# EasyEDA schematic SCH_YY.json
TITLE: Sheet_1; REV: 1.0; Date: 2026-08-25; Sheet: 1/1; Drawn By: minionmark; Company: Your Company
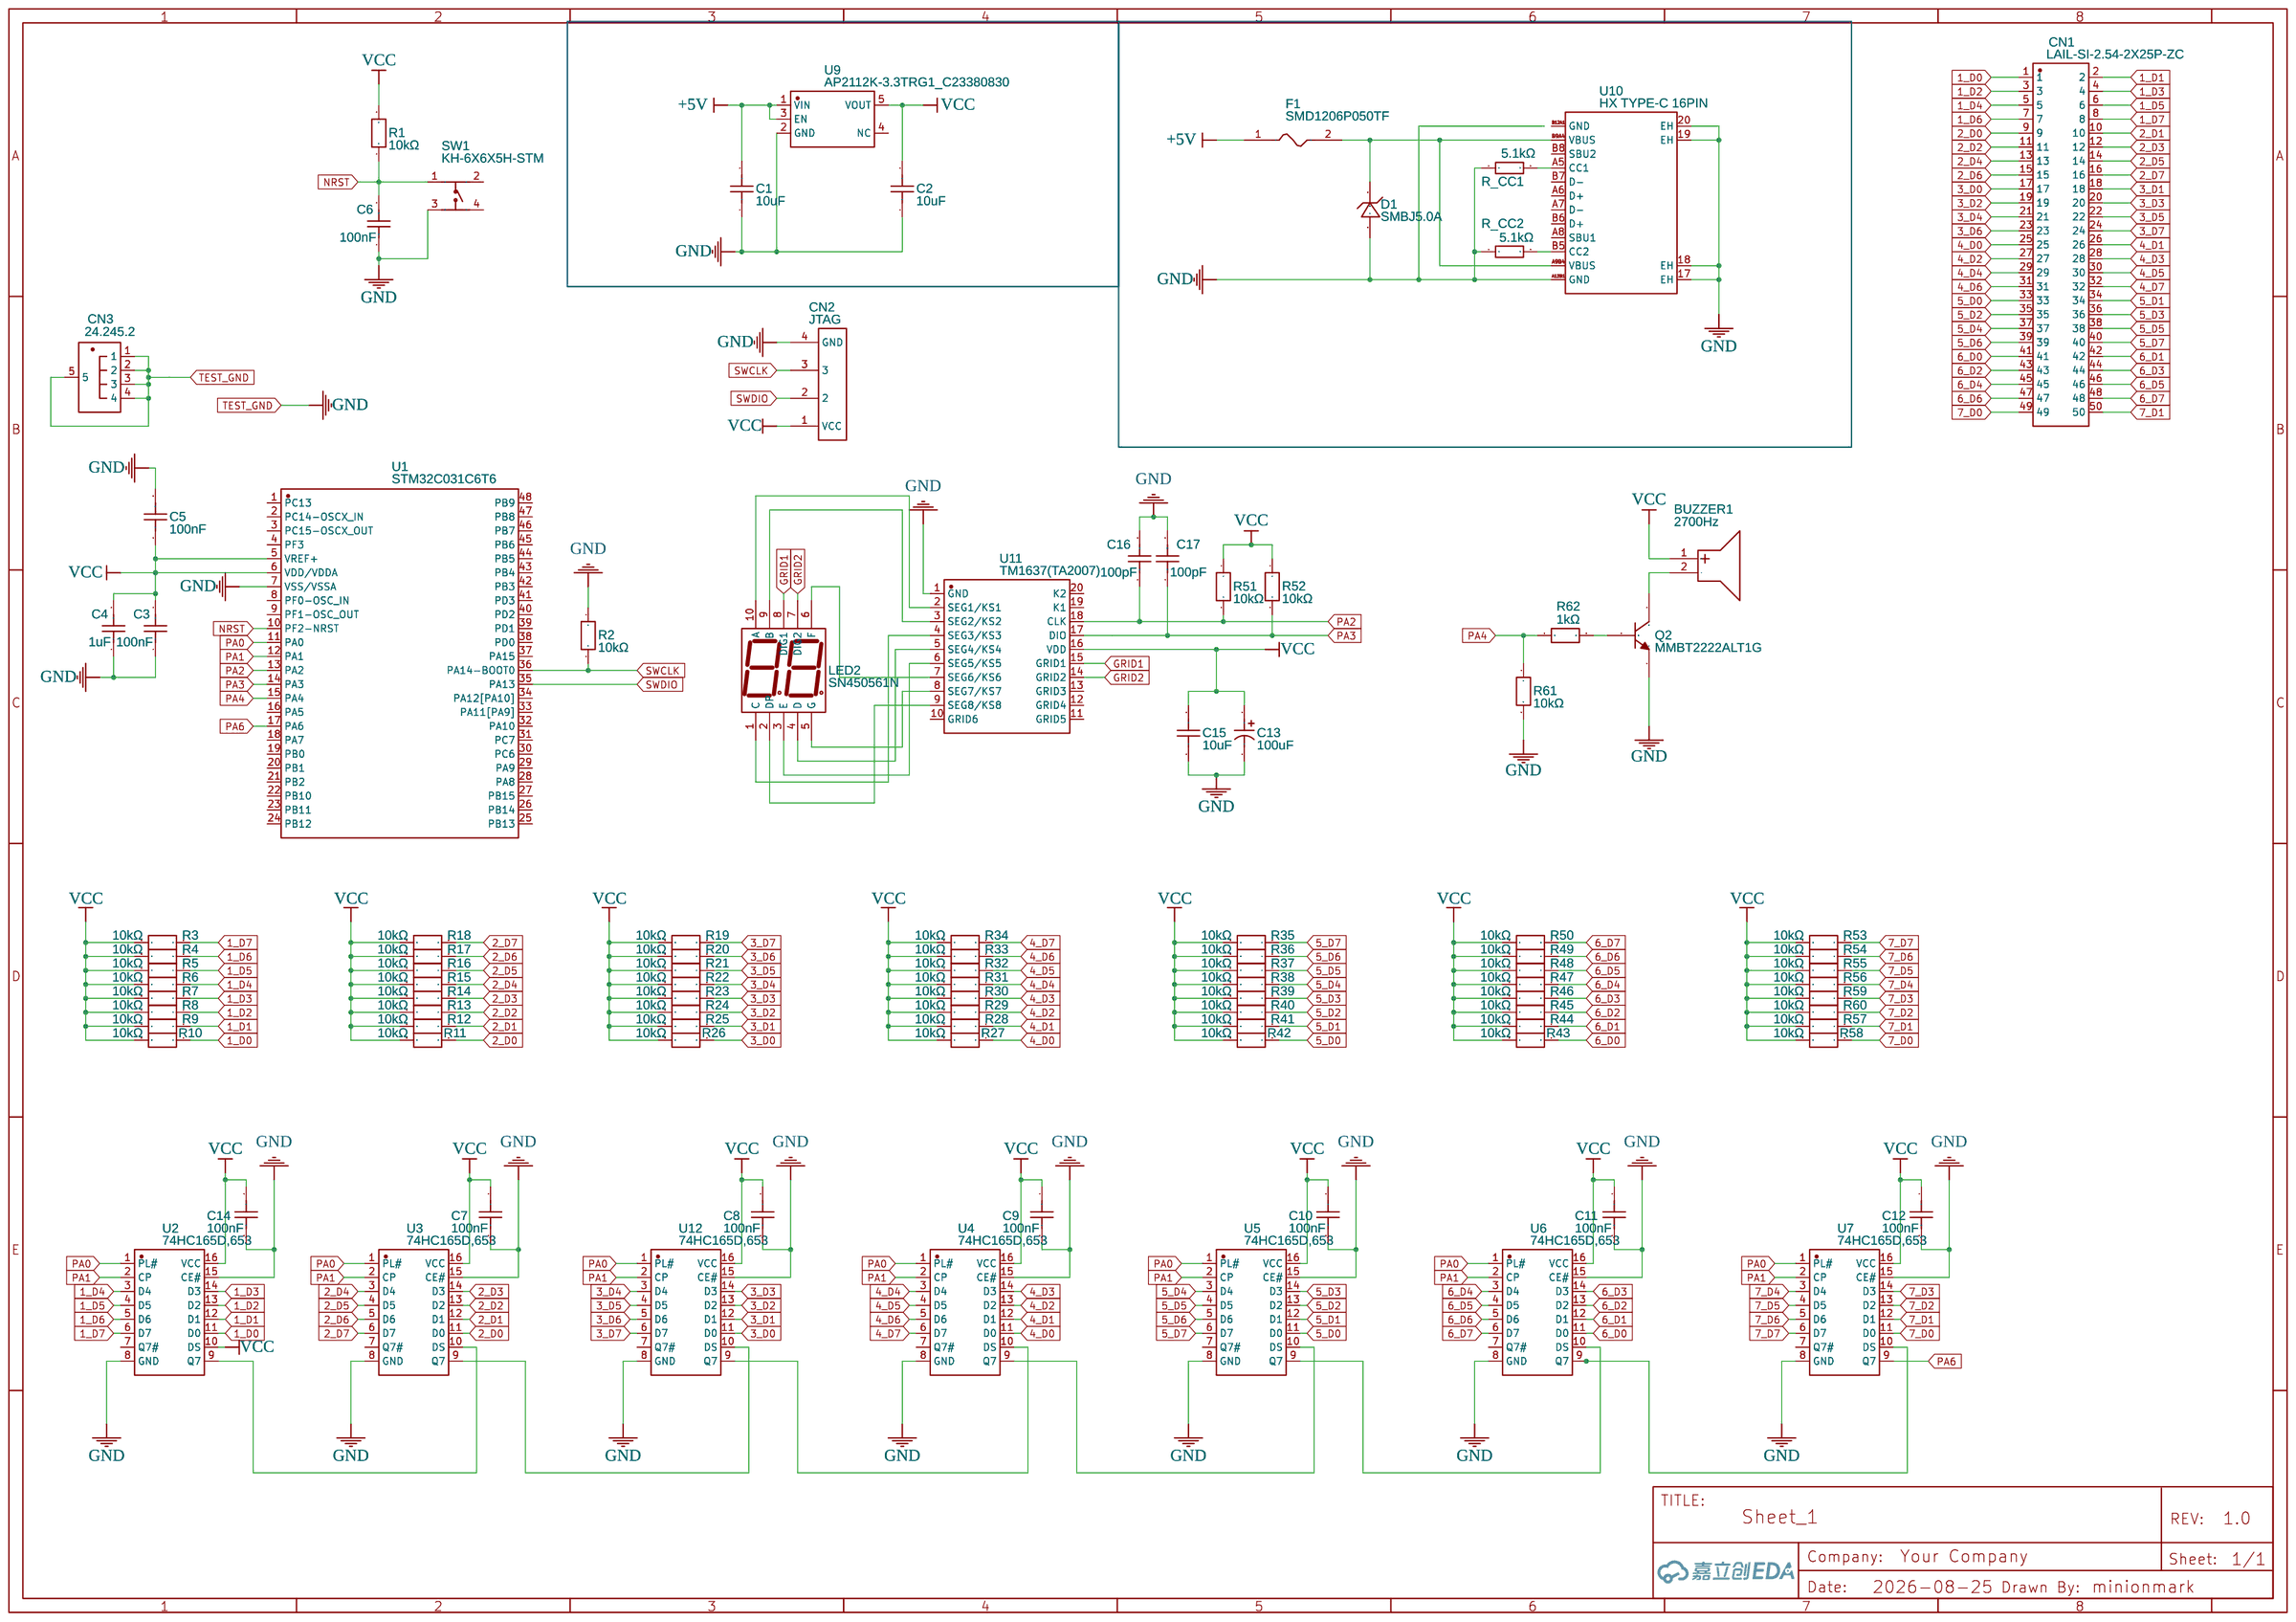
[diagram p0: schematic sheet]

## Parts
BUZZER1  2700Hz  [BUZ-SMD_GSD9605YB-3V2800]
C1  10uF  [C0603]
C2  10uF  [C0603]
C3  100nF  [C0603]
C4  1uF  [C0603]
C5  100nF  [C0603]
C6  100nF  [C0603]
C7  100nF  [C0603]
C8  100nF  [C0603]
C9  100nF  [C0603]
C10  100nF  [C0603]
C11  100nF  [C0603]
C12  100nF  [C0603]
C13  100uF  [CAP-SMD_BD6.3-L6.6-W6.6-FD-1]
C14  100nF  [C0603]
C15  10uF  [C0603]
C16  100pF  [C0603]
C17  100pF  [C0603]
CN1  LAIL-SI-2.54-2X25P-ZC  [IDC-TH_50P-P2.54-V-M-R2-C25-S2.54]
CN2  JTAG  [JTAG]
CN3  24.245.2  [ANT-TH_L33.0-W12.0_BLACK]
D1  SMBJ5.0A  [SMB_L4.6-W3.6-LS5.3-RD]
F1  SMD1206P050TF  [F1206]
LED2  SN450561N  [LED-SEG-TH_10P-L25.0-W19.0-P2.54-S15.24-BL]
Q2  MMBT2222ALT1G  [SOT-23-3_L2.9-W1.3-P1.90-LS2.4-BR]
R1  10kΩ  [R0603]
R2  10kΩ  [R0603]
R3  10kΩ  [R0603]
R4  10kΩ  [R0603]
R5  10kΩ  [R0603]
R6  10kΩ  [R0603]
R7  10kΩ  [R0603]
R8  10kΩ  [R0603]
R9  10kΩ  [R0603]
R10  10kΩ  [R0603]
R11  10kΩ  [R0603]
R12  10kΩ  [R0603]
R13  10kΩ  [R0603]
R14  10kΩ  [R0603]
R15  10kΩ  [R0603]
R16  10kΩ  [R0603]
R17  10kΩ  [R0603]
R18  10kΩ  [R0603]
R19  10kΩ  [R0603]
R20  10kΩ  [R0603]
R21  10kΩ  [R0603]
R22  10kΩ  [R0603]
R23  10kΩ  [R0603]
R24  10kΩ  [R0603]
R25  10kΩ  [R0603]
R26  10kΩ  [R0603]
R27  10kΩ  [R0603]
R28  10kΩ  [R0603]
R29  10kΩ  [R0603]
R30  10kΩ  [R0603]
R31  10kΩ  [R0603]
R32  10kΩ  [R0603]
R33  10kΩ  [R0603]
R34  10kΩ  [R0603]
R35  10kΩ  [R0603]
R36  10kΩ  [R0603]
R37  10kΩ  [R0603]
R38  10kΩ  [R0603]
R39  10kΩ  [R0603]
R40  10kΩ  [R0603]
R41  10kΩ  [R0603]
R42  10kΩ  [R0603]
R43  10kΩ  [R0603]
R44  10kΩ  [R0603]
R45  10kΩ  [R0603]
R46  10kΩ  [R0603]
R47  10kΩ  [R0603]
R48  10kΩ  [R0603]
R49  10kΩ  [R0603]
R50  10kΩ  [R0603]
R51  10kΩ  [R0603]
R52  10kΩ  [R0603]
R53  10kΩ  [R0603]
R54  10kΩ  [R0603]
R55  10kΩ  [R0603]
R56  10kΩ  [R0603]
R57  10kΩ  [R0603]
R58  10kΩ  [R0603]
R59  10kΩ  [R0603]
R60  10kΩ  [R0603]
R61  10kΩ  [R0603]
R62  1kΩ  [R0603]
R_CC1  5.1kΩ  [R0603]
R_CC2  5.1kΩ  [R0603]
SW1  KH-6X6X5H-STM  [SW-SMD_4P-L6.0-W6.0-P4.50-LS9.0_H5.0]
U1  STM32C031C6T6  [LQFP-48_L7.0-W7.0-P0.50-LS9.0-BL]
U2  74HC165D,653  [SOIC-16_L9.9-W3.9-P1.27-LS6.0-BL]
U3  74HC165D,653  [SOIC-16_L9.9-W3.9-P1.27-LS6.0-BL]
U4  74HC165D,653  [SOIC-16_L9.9-W3.9-P1.27-LS6.0-BL]
U5  74HC165D,653  [SOIC-16_L9.9-W3.9-P1.27-LS6.0-BL]
U6  74HC165D,653  [SOIC-16_L9.9-W3.9-P1.27-LS6.0-BL]
U7  74HC165D,653  [SOIC-16_L9.9-W3.9-P1.27-LS6.0-BL]
U9  AP2112K-3.3TRG1_C23380830  [SOT-23-5_L2.9-W1.6-P0.95-LS2.8-BR]
U10  HX TYPE-C 16PIN  [TYPE-C-SMD_HX-TYPE-C-16PIN]
U11  TM1637(TA2007)  [SOP-20_L12.8-W7.5-P1.27-LS10.4-BL]
U12  74HC165D,653  [SOIC-16_L9.9-W3.9-P1.27-LS6.0-BL]

## Library data of the parts
BUZZER1 = GSD9605YB-3V2800: Contributor: LCSC; Supplier: LCSC; Supplier Part: C255327; Manufacturer: INGHAi(赢海); JLCPCB Part Class: Extended Part
C1 C2 C15 = FCC0603X106K100CT: Contributor: lcsc; Supplier: LCSC; Supplier Part: C5137565; Manufacturer: FOJAN(富捷); JLCPCB Part Class: Extended Part
C3 C5-C12 C14 = 0603ZD104KAT2A: Supplier: LCSC; Supplier Part: C1856507; Manufacturer: Kyocera AVX; JLCPCB Part Class: Extended Part; Contributor: lcsc
C4 = 0603X105K100NT: Contributor: LCSC; Supplier: LCSC; Supplier Part: C111590; Manufacturer: FH(风华); JLCPCB Part Class: Extended Part; link: https://so.szlcsc.com/global.html?k=C111590&ref=editor
C13 = JVJ25V100M6X5: Supplier: LCSC; Supplier Part: C46550402; Manufacturer: JIERR(捷而瑞); Manufacturer Part: JVJ25V100M6x5; JLCPCB Part Class: Extended Part; Contributor: lcsc
C16 C17 = CC0603JRNPO9BN101: Supplier: LCSC; Manufacturer: YAGEO(国巨); Supplier Part: C14665; JLCPCB Part Class: Extended Part
CN1 = LAIL-SI-2.54-2X25P-ZC: Supplier: LCSC; Supplier Part: C55118377; Manufacturer: 莱联; Contributor: lcsc; JLCPCB Part Class: Extended Part
CN2 = JTAG: Contributor: minionmark; Package Display: No
CN3 = 24.245.2: Supplier: LCSC; Supplier Part: C7437327; Manufacturer: AMASS(艾迈斯); Contributor: lcsc; JLCPCB Part Class: Extended Part
D1 = SMBJ5.0A-C113974: Supplier: LCSC; Manufacturer: MDD(辰达半导体); Supplier Part: C113974; JLCPCB Part Class: Extended Part
F1 = SMD1206P050TF: Supplier: LCSC; Manufacturer: RUILON(瑞隆源); Supplier Part: C20799; JLCPCB Part Class: Extended Part
LED2 = SN450561N: Contributor: LCSC; Supplier: LCSC; Supplier Part: C193143; Manufacturer: ARKLED(方舟); JLCPCB Part Class: Extended Part
Q2 = MMBT2222ALT1G: Supplier: LCSC; Manufacturer: onsemi(安森美); Supplier Part: C82460; JLCPCB Part Class: Extended Part
R1-R61 = FRC0603J103TS: Contributor: LCSC; Supplier: LCSC; Supplier Part: C2930027; Manufacturer: FOJAN(富捷); Manufacturer Part: FRC0603J103 TS; JLCPCB Part Class: Extended Part
R62 = FRC0603F1001TS: Contributor: lcsc; Supplier: LCSC; Supplier Part: C2907002; Manufacturer: FOJAN(富捷); JLCPCB Part Class: Extended Part
R_CC1 R_CC2 = RT0603BRD075K1L: Supplier: LCSC; Manufacturer: YAGEO(国巨); Supplier Part: C122969; JLCPCB Part Class: Extended Part
SW1 = KH-6X6X5H-STM: Contributor: LCSC; Supplier: LCSC; Supplier Part: C2837531; Manufacturer: kinghelm(金航标); JLCPCB Part Class: Extended Part
U1 = STM32C031C6T6: Contributor: lcsc; Supplier: LCSC; Supplier Part: C5456218; Manufacturer: ST(意法半导体); JLCPCB Part Class: Extended Part
U2-U7 U12 = 74HC165D,653: Supplier: LCSC; Manufacturer: Nexperia(安世); Supplier Part: C5613; JLCPCB Part Class: Extended Part
U9 = AP2112K-3.3TRG1_C23380830: Supplier: LCSC; Supplier Part: C23380830; Manufacturer: TECH PUBLIC(台舟); Manufacturer Part: AP2112K-3.3TRG1; Contributor: lcsc; JLCPCB Part Class: Extended Part
U10 = HX TYPE-C 16PIN: Supplier: LCSC; Supplier Part: C5178539; Manufacturer: hanxia(韩下); JLCPCB Part Class: Extended Part; Contributor: lcsc
U11 = TM1637(TA2007): Contributor: lcsc; Supplier: LCSC; Supplier Part: C5337160; Manufacturer: TM(天微); JLCPCB Part Class: Extended Part

## Nets
+5V: C1.2 F1.1 U9.1(VIN) U9.3(EN)
GND: C1.1 C2.1 C3.1 C4.1 C5.2 C6.1 C7.2 C8.2 C9.2 C10.2 C11.2 C12.2 C13.2 C14.2 C15.1 C16.2 C17.2 CN2.4(GND) CN3.1 CN3.2 CN3.3 CN3.4 CN3.5 D1.2(A) Q2.2(E) R2.1 R61.2 R_CC1.1 R_CC2.1 SW1.3 U1.7(VSS/VSSA) U2.8(GND) U2.15(CE#) U3.8(GND) U3.15(CE#) U4.8(GND) U4.15(CE#) U5.8(GND) U5.15(CE#) U6.8(GND) U6.15(CE#) U7.8(GND) U7.15(CE#) U9.2(GND) U10.17(EH) U10.18(EH) U10.19(EH) U10.20(EH) U10.A12B1(GND) U11.1(GND) U12.8(GND) U12.15(CE#)
VCC: BUZZER1.1(+) C2.2 C3.2 C4.2 C5.1 C7.1 C8.1 C9.1 C10.1 C11.1 C12.1 C13.1 C14.1 C15.2 CN2.1(VCC) R1.2 R3.2 R4.2 R5.2 R6.2 R7.2 R8.2 R9.2 R10.2 R11.2 R12.2 R13.2 R14.2 R15.2 R16.2 R17.2 R18.2 R19.2 R20.2 R21.2 R22.2 R23.2 R24.2 R25.2 R26.2 R27.2 R28.2 R29.2 R30.2 R31.2 R32.2 R33.2 R34.2 R35.2 R36.2 R37.2 R38.2 R39.2 R40.2 R41.2 R42.2 R43.2 R44.2 R45.2 R46.2 R47.2 R48.2 R49.2 R50.2 R51.1 R52.1 R53.2 R54.2 R55.2 R56.2 R57.2 R58.2 R59.2 R60.2 U1.5(VREF+) U1.6(VDD/VDDA) U2.10(DS) U2.16(VCC) U3.16(VCC) U4.16(VCC) U5.16(VCC) U6.16(VCC) U7.16(VCC) U9.5(VOUT) U11.16(VDD) U12.16(VCC)
1_D0: CN1.1 R10.1 U2.11(D0)
1_D1: CN1.2 R9.1 U2.12(D1)
1_D2: CN1.3 R8.1 U2.13(D2)
1_D3: CN1.4 R7.1 U2.14(D3)
1_D4: CN1.5 R6.1 U2.3(D4)
1_D5: CN1.6 R5.1 U2.4(D5)
1_D6: CN1.7 R4.1 U2.5(D6)
1_D7: CN1.8 R3.1 U2.6(D7)
2_D0: CN1.9 R11.1 U3.11(D0)
2_D1: CN1.10 R12.1 U3.12(D1)
2_D2: CN1.11 R13.1 U3.13(D2)
2_D3: CN1.12 R14.1 U3.14(D3)
2_D4: CN1.13 R15.1 U3.3(D4)
2_D5: CN1.14 R16.1 U3.4(D5)
2_D6: CN1.15 R17.1 U3.5(D6)
2_D7: CN1.16 R18.1 U3.6(D7)
3_D0: CN1.17 R26.1 U12.11(D0)
3_D1: CN1.18 R25.1 U12.12(D1)
3_D2: CN1.19 R24.1 U12.13(D2)
3_D3: CN1.20 R23.1 U12.14(D3)
3_D4: CN1.21 R22.1 U12.3(D4)
3_D5: CN1.22 R21.1 U12.4(D5)
3_D6: CN1.23 R20.1 U12.5(D6)
3_D7: CN1.24 R19.1 U12.6(D7)
4_D0: CN1.25 R27.1 U4.11(D0)
4_D1: CN1.26 R28.1 U4.12(D1)
4_D2: CN1.27 R29.1 U4.13(D2)
4_D3: CN1.28 R30.1 U4.14(D3)
4_D4: CN1.29 R31.1 U4.3(D4)
4_D5: CN1.30 R32.1 U4.4(D5)
4_D6: CN1.31 R33.1 U4.5(D6)
4_D7: CN1.32 R34.1 U4.6(D7)
5_D0: CN1.33 R42.1 U5.11(D0)
5_D1: CN1.34 R41.1 U5.12(D1)
5_D2: CN1.35 R40.1 U5.13(D2)
5_D3: CN1.36 R39.1 U5.14(D3)
5_D4: CN1.37 R38.1 U5.3(D4)
5_D5: CN1.38 R37.1 U5.4(D5)
5_D6: CN1.39 R36.1 U5.5(D6)
5_D7: CN1.40 R35.1 U5.6(D7)
6_D0: CN1.41 R43.1 U6.11(D0)
6_D1: CN1.42 R44.1 U6.12(D1)
6_D2: CN1.43 R45.1 U6.13(D2)
6_D3: CN1.44 R46.1 U6.14(D3)
6_D4: CN1.45 R47.1 U6.3(D4)
6_D5: CN1.46 R48.1 U6.4(D5)
6_D6: CN1.47 R49.1 U6.5(D6)
6_D7: CN1.48 R50.1 U6.6(D7)
7_D0: CN1.49 R58.1 U7.11(D0)
7_D1: CN1.50 R57.1 U7.12(D1)
7_D2: R60.1 U7.13(D2)
7_D3: R59.1 U7.14(D3)
7_D4: R56.1 U7.3(D4)
7_D5: R55.1 U7.4(D5)
7_D6: R54.1 U7.5(D6)
7_D7: R53.1 U7.6(D7)
GRID1: LED2.8(DIG1) U11.15(GRID1)
GRID2: LED2.7(DIG2) U11.14(GRID2)
NRST: C6.2 R1.1 SW1.1 U1.10(PF2-NRST)
PA0: U1.11(PA0) U2.1(PL#) U3.1(PL#) U4.1(PL#) U5.1(PL#) U6.1(PL#) U7.1(PL#) U12.1(PL#)
PA1: U1.12(PA1) U2.2(CP) U3.2(CP) U4.2(CP) U5.2(CP) U6.2(CP) U7.2(CP) U12.2(CP)
PA2: C16.1 R51.2 U1.13(PA2) U11.18(CLK)
PA3: C17.1 R52.2 U1.14(PA3) U11.17(DIO)
PA4: R61.1 R62.1 U1.15(PA4)
PA6: U1.17(PA6) U7.9(Q7)
SWCLK: CN2.3 R2.2 U1.36(PA14-BOOT0)
SWDIO: CN2.2 U1.35(PA13)
Net-(BUZZER1-2): BUZZER1.2(-) Q2.3(C)
Net-(D1-1): D1.1(C) F1.2 U10.A9B4(VBUS) U10.B9A4(VBUS)
Net-(LED2-1): LED2.1(C) U11.4(SEG3/KS3)
Net-(LED2-2): LED2.2(DP) U11.9(SEG8/KS8)
Net-(LED2-3): LED2.3(E) U11.6(SEG5/KS5)
Net-(LED2-4): LED2.4(D) U11.5(SEG4/KS4)
Net-(LED2-5): LED2.5(G) U11.8(SEG7/KS7)
Net-(LED2-6): LED2.6(F) U11.7(SEG6/KS6)
Net-(LED2-9): LED2.9(B) U11.3(SEG2/KS2)
Net-(LED2-10): LED2.10(A) U11.2(SEG1/KS1)
Net-(Q2-1): Q2.1(B) R62.2
Net-(R_CC1-2): R_CC1.2 U10.A5(CC1)
Net-(R_CC2-2): R_CC2.2 U10.B5(CC2)
Net-(U2-9): U2.9(Q7) U3.10(DS)
Net-(U3-9): U3.9(Q7) U12.10(DS)
Net-(U4-9): U4.9(Q7) U5.10(DS)
Net-(U4-10): U4.10(DS) U12.9(Q7)
Net-(U5-9): U5.9(Q7) U6.10(DS)
Net-(U6-9): U6.9(Q7) U7.10(DS)

Not connected (* = marked no-connect by the designer): SW1 2 4; U1 1(PC13) 2(PC14-OSCX_IN) 3(PC15-OSCX_OUT) 4(PF3) 8(PF0-OSC_IN) 9(PF1-OSC_OUT) 16(PA5) 18(PA7) 19(PB0) 20(PB1) 21(PB2) 22(PB10) 23(PB11) 24(PB12) 25(PB13) 26(PB14) 27(PB15) 28(PA8) 29(PA9) 30(PC6) 31(PC7) 32(PA10) 33(PA11[PA9]) 34(PA12[PA10]) 37(PA15) 38(PD0) 39(PD1) 40(PD2) 41(PD3) 42(PB3) 43(PB4) 44(PB5) 45(PB6) 46(PB7) 47(PB8) 48(PB9); U2 7(Q7#); U3 7(Q7#); U4 7(Q7#); U5 7(Q7#); U6 7(Q7#); U7 7(Q7#); U9 4(NC); U10 A6(D+) A7(D-) A8(SBU1) B6(D+) B7(D-) B8(SBU2) B12A1(GND); U11 10(GRID6) 11(GRID5) 12(GRID4) 13(GRID3) 19(K1) 20(K2); U12 7(Q7#)
